# Altium schematic sheet Communication.SchDoc
size A4
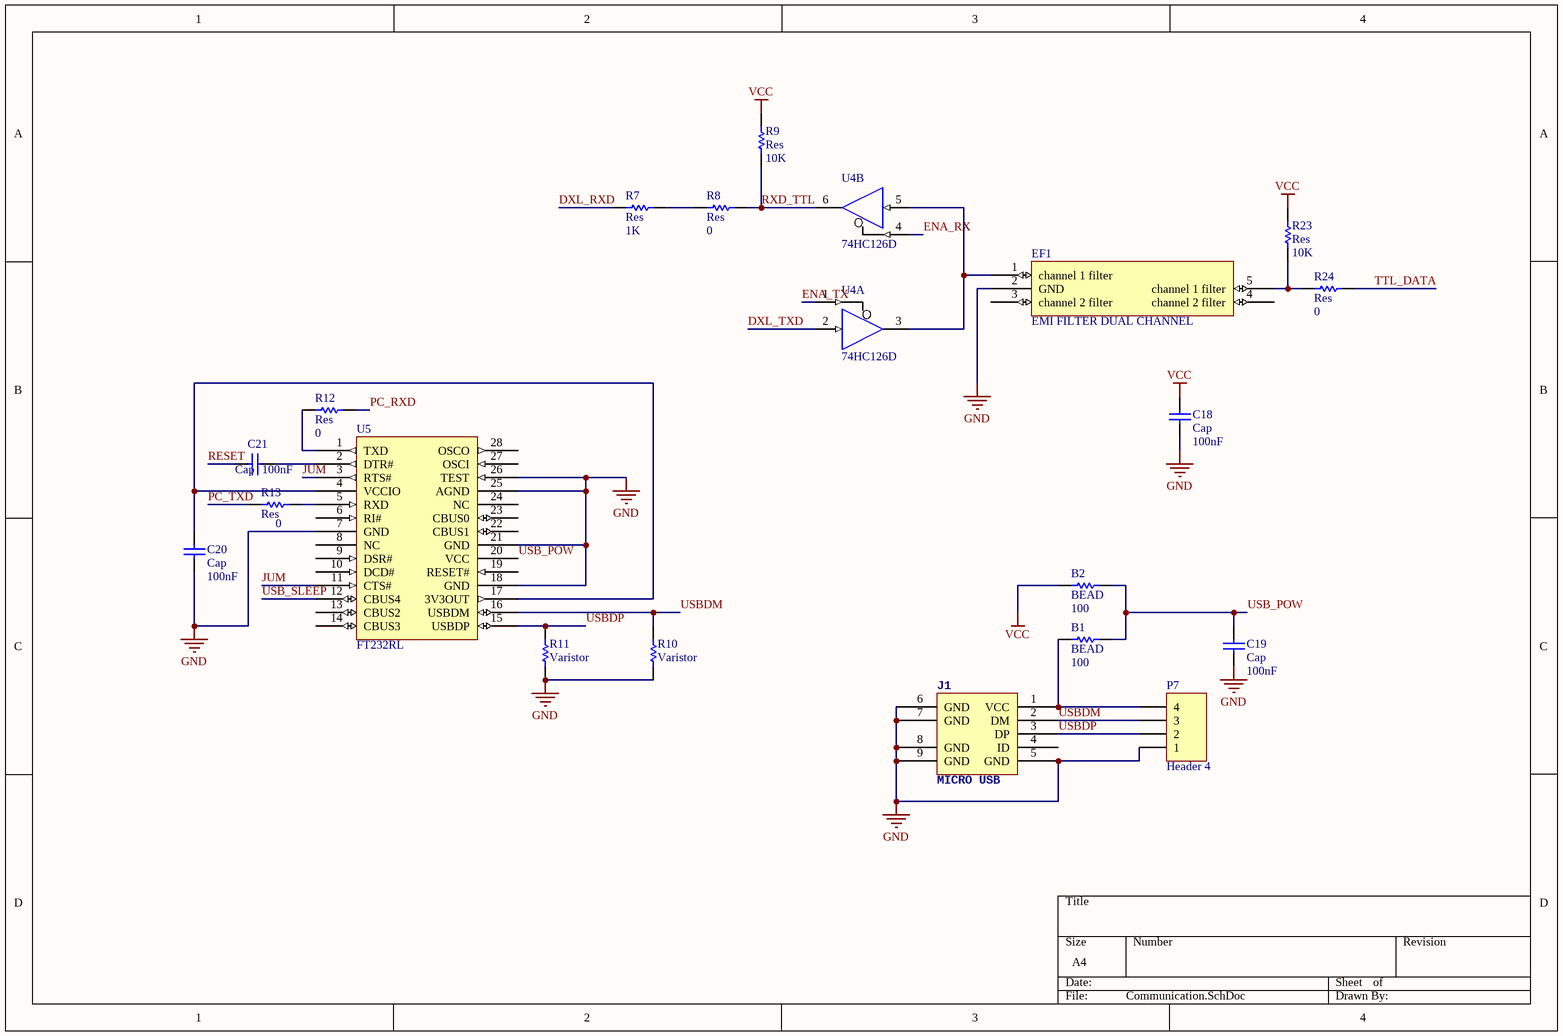
[diagram p0: Communication.SchDoc]

## Parts
B1  BEAD  value 100  [0603-RES]
B2  BEAD  value 100  [0603-RES]
C18  Cap  value 100nF  [0603-CAP]
C19  Cap  value 100nF  [0603-CAP]
C20  Cap  value 100nF  [0603-CAP]
C21  Cap  value 100nF  [0603-CAP]
EF1  EMI FILTER DUAL CHANNEL  [Emi Filter Dual Channel SOTFL]
J1  MICRO USB  [USB_MICRO]
P7  Header 4  [HDR1X4]
R7  Res  value 1K  [0603-RES]
R8  Res  value 0  [0603-RES]
R9  Res  value 10K  [0603-RES]
R10  Varistor  [0603-RES]
R11  Varistor  [0603-RES]
R12  Res  value 0  [0603-RES]
R13  Res  value 0  [0603-RES]
R23  Res  value 10K  [0603-RES]
R24  Res  value 0  [0603-RES]
U4  74HC126D  [14-SOIC]  (parts A,B of 4)
U5  FT232RL  [USB TO SERIAL FT232RL SOP]

## Nets
GND: C18.1 C19.1 C20.1 EF1.2(GND) J1.5(GND) J1.6(GND) J1.7(GND) J1.8(GND) J1.9(GND) P7.1 R10.1 R11.1 U4.7(GND) U5.7(GND) U5.18(GND) U5.21(GND) U5.25(AGND) U5.26(TEST)
VCC: B2.1 C18.2 R9.2 R23.2 U4.14(VCC)
DXL_RXD: R7.1
DXL_TXD: U4.2(A)
ENA_RX: U4.4(OE)
ENA_TX: U4.1(OE)
JUM: U5.3(RTS#) U5.11(CTS#)
PC_RXD: R12.2
PC_TXD: R13.2
RESET: C21.2
RXD_TTL: R8.2 R9.1 U4.6(Y)
TTL_DATA: R24.2
USB_POW: B1.2 B2.2 C19.2 U5.20(VCC)
USB_SLEEP: U5.12(CBUS4)
USBDM: J1.2(DM) P7.3 R10.2 U5.16(USBDM)
USBDP: J1.3(DP) P7.2 R11.2 U5.15(USBDP)
NetB1_1: B1.1 J1.1(VCC) P7.4
NetC20_2: C20.2 U5.4(VCCIO) U5.17(3V3OUT)
NetC21_1: C21.1 U5.2(DTR#)
NetEF1_1: EF1.1(channel_1_filter) U4.3(Y) U4.5(A)
NetEF1_5: EF1.5(channel_1_filter) R23.1 R24.1
NetR7_2: R7.2 R8.1
NetR12_1: R12.1 U5.1(TXD)
NetR13_1: R13.1 U5.5(RXD)

Not connected (* = marked no-connect by the designer): EF1 3(channel_2_filter) 4(channel_2_filter); J1 4(ID); U5 6(RI#) 8(NC) 9(DSR#) 10(DCD#) 13(CBUS2) 14(CBUS3) 19(RESET#) 22(CBUS1) 23(CBUS0) 24(NC) 27(OSCI) 28(OSCO)

## Library data of the parts
B1 B2 R7-R9 R12 R13 R23 R24 = Res: Resistor; Published: 8-Jun-2000; LatestRevisionDate: 17-Jul-2002; LatestRevisionNote: Re-released for DXP Platform.; PackageReference: AXIAL-0.3; Publisher: Altium Limited; PackageDescription: Axial Device, Thru-Hole; 2 Leads; 0.3 in Pin Spacing
C18-C21 = Cap: Capacitor; Published: 8-Jun-2000; LatestRevisionDate: 17-Jul-2002; LatestRevisionNote: Re-released for DXP Platform.; PackageReference: RAD-0.3; Publisher: Altium Limited; PackageDescription: Radial Cap, Thru-Hole; 2 Leads; 0.3 in Pin Spacing
P7 = Header 4: Header, 4-Pin; LatestRevisionDate: 17-Jul-2002; LatestRevisionNote: Re-released for DXP Platform.; Publisher: Altium Limited
R10 R11 = Res: Resistor; Value: 0; Published: 8-Jun-2000; LatestRevisionDate: 17-Jul-2002; LatestRevisionNote: Re-released for DXP Platform.; PackageReference: AXIAL-0.3; Publisher: Altium Limited; PackageDescription: Axial Device, Thru-Hole; 2 Leads; 0.3 in Pin Spacing
U4 = 74HC126D: Quadruple Bus Buffer Gate with 3-State Outputs; Published: 8-Jun-2000; LatestRevisionDate: 13-Apr-2006; LatestRevisionNote: IPC-7351 Footprint Added.; DatasheetVersion: Oct-1998; PackageVersion: Jan-1998; PackageReference: D014; Publisher: Altium Limited; PackageDescription: 14-Pin Small Outline Integrated Circuit 1.27 mm Pitch; Code_IPC: SOIC127P600-14; ComponentLink1Description: Manufacturer Link; ComponentLink1URL: http://www.ti.com/; ComponentLink2Description: Datasheet; ComponentLink2URL: http://www-s.ti.com/sc/ds/sn74ahct126.pdf